# Altium schematic sheet Arduino_and_Clock_Source.SchDoc
size A4
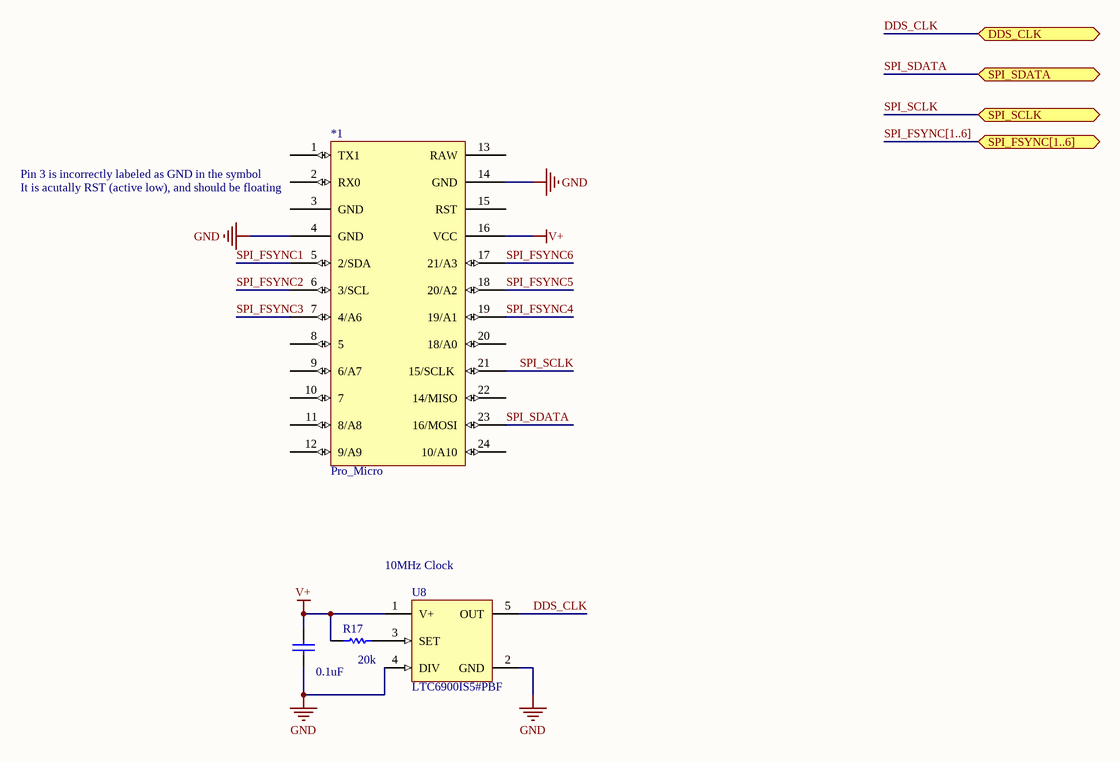
[diagram p0: Arduino_and_Clock_Source.SchDoc]

## Parts
*1  Pro_Micro  [Pro_Micro]
C22  0.1uF  [1608[0603]]
R17  20k  [6-0805_M]
U8  LTC6900IS5#PBF  [LT-TSOT-23-5_V]

## Ports
DDS_CLK (bidir), SPI_FSYNC[1..6] (bidir), SPI_SCLK (bidir), SPI_SDATA (bidir)

## Nets
GND: *1.4(GND) *1.14(GND) C22.1 U8.2(GND) U8.4(DIV)
V+: *1.16(VCC) C22.2 R17.1 U8.1(V+)
DDS_CLK: U8.5(OUT) ; port DDS_CLK
SPI_FSYNC1: *1.5(2/SDA)
SPI_FSYNC2: *1.6(3/SCL)
SPI_FSYNC3: *1.7(4/A6)
SPI_FSYNC4: *1.19(19/A1)
SPI_FSYNC5: *1.18(20/A2)
SPI_FSYNC6: *1.17(21/A3)
SPI_SCLK: *1.21(15/SCLK) ; port SPI_SCLK
SPI_SDATA: *1.23(16/MOSI) ; port SPI_SDATA
NetR17_2: R17.2 U8.3(SET)

Not connected (* = marked no-connect by the designer): *1 1(TX1) 2(RX0) 3(GND) 8(5) 9(6/A7) 10(7) 11(8/A8) 12(9/A9) 13(RAW) 15(RST) 20(18/A0) 22(14/MISO) 24(10/A10)

## Buses and harness runs
bus SPI_FSYNC[1..6] = port SPI_FSYNC[1..6]

## Notes on the sheet
- (near *1) Pin 3 is incorrectly labeled as GND in the symbol
- (near *1) It is acutally RST (active low), and should be floating
- (near U8) 10MHz Clock

## Library data of the parts
C22 = Cap Semi: Capacitor (Semiconductor SIM Model); Published: 8-Jun-2000; LatestRevisionDate: 29-May-2009; LatestRevisionNote: IPC-7351 Footprint Added.; PackageReference: C1206; Publisher: Altium Limited; PackageDescription: Chip Capacitor; Value: 0.1uF
R17 = Res1: Resistor; Published: 8-Jun-2000; LatestRevisionDate: 17-Jul-2002; LatestRevisionNote: Re-released for DXP Platform.; PackageReference: AXIAL-0.3; Publisher: Altium Limited; PackageDescription: Axial Device, Thru-Hole; 2 Leads; 0.3 in Pin Spacing; Value: 20k
U8 = CMP-2000-06612-1: Low Power, Resistor Set Oscillator, 1 KHz to 20 MHz, 2.7 to 5.5 V, -40 to 85 degC, 5-Pin SOT-23 (S5), Pb-Free; Manufacturer: Linear Technology; Frequency: 20MHz; Supply Voltage Range: 2.7Vto5.5V; Supply Voltage Min: 2.7V; Supply Voltage Max: 5.5V; Base Number: 6900; SVHC: NoSVHC(19-Dec-2012); No. of Pins: 5; Clock External Input: No; Operating Temperature Min: -40°C; Operating Temperature Range: -40°Cto+85°C; Manufacturer URL: http://www.linear.com/; Operating Frequency Max: 20MHz; Package Description: 5-Pin Small Outline Transistor, Body 2.9 x 1.625 mm, Pitch 0.95 mm; Operating Temperature Max: 85°C; MSL: MSL1-Unlimited; Datasheet Version: Rev. A, 07/2009; Package / Case: SOT-23; Datasheet URL: http://cds.linear.com/docs/en/datasheet/6900fa.pdf; Termination Type: SMD; Package Reference: TSOT23-5; Mounting Technology: SurfaceMount; Digital IC Case Style: SOT-23